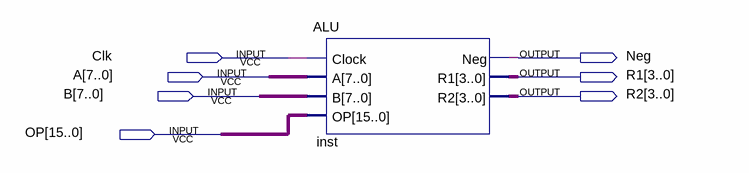
[diagram p0: schematic sheet]
// Quartus schematic ALUcore.bdf as structural Verilog: 1 symbols, 7 pins
module ALUcore (
  input  Clk,
  input  [7:0] A,
  input  [7:0] B,
  input  [15:0] OP,
  output Neg,
  output [3:0] R1,
  output [3:0] R2
);

  ALU inst (.Clock(Clk), .A(A), .B(B), .OP(OP), .Neg(Neg), .R1(R1), .R2(R2));
endmodule
